# EAGLE schematic hydra (EAGLE 5.06)
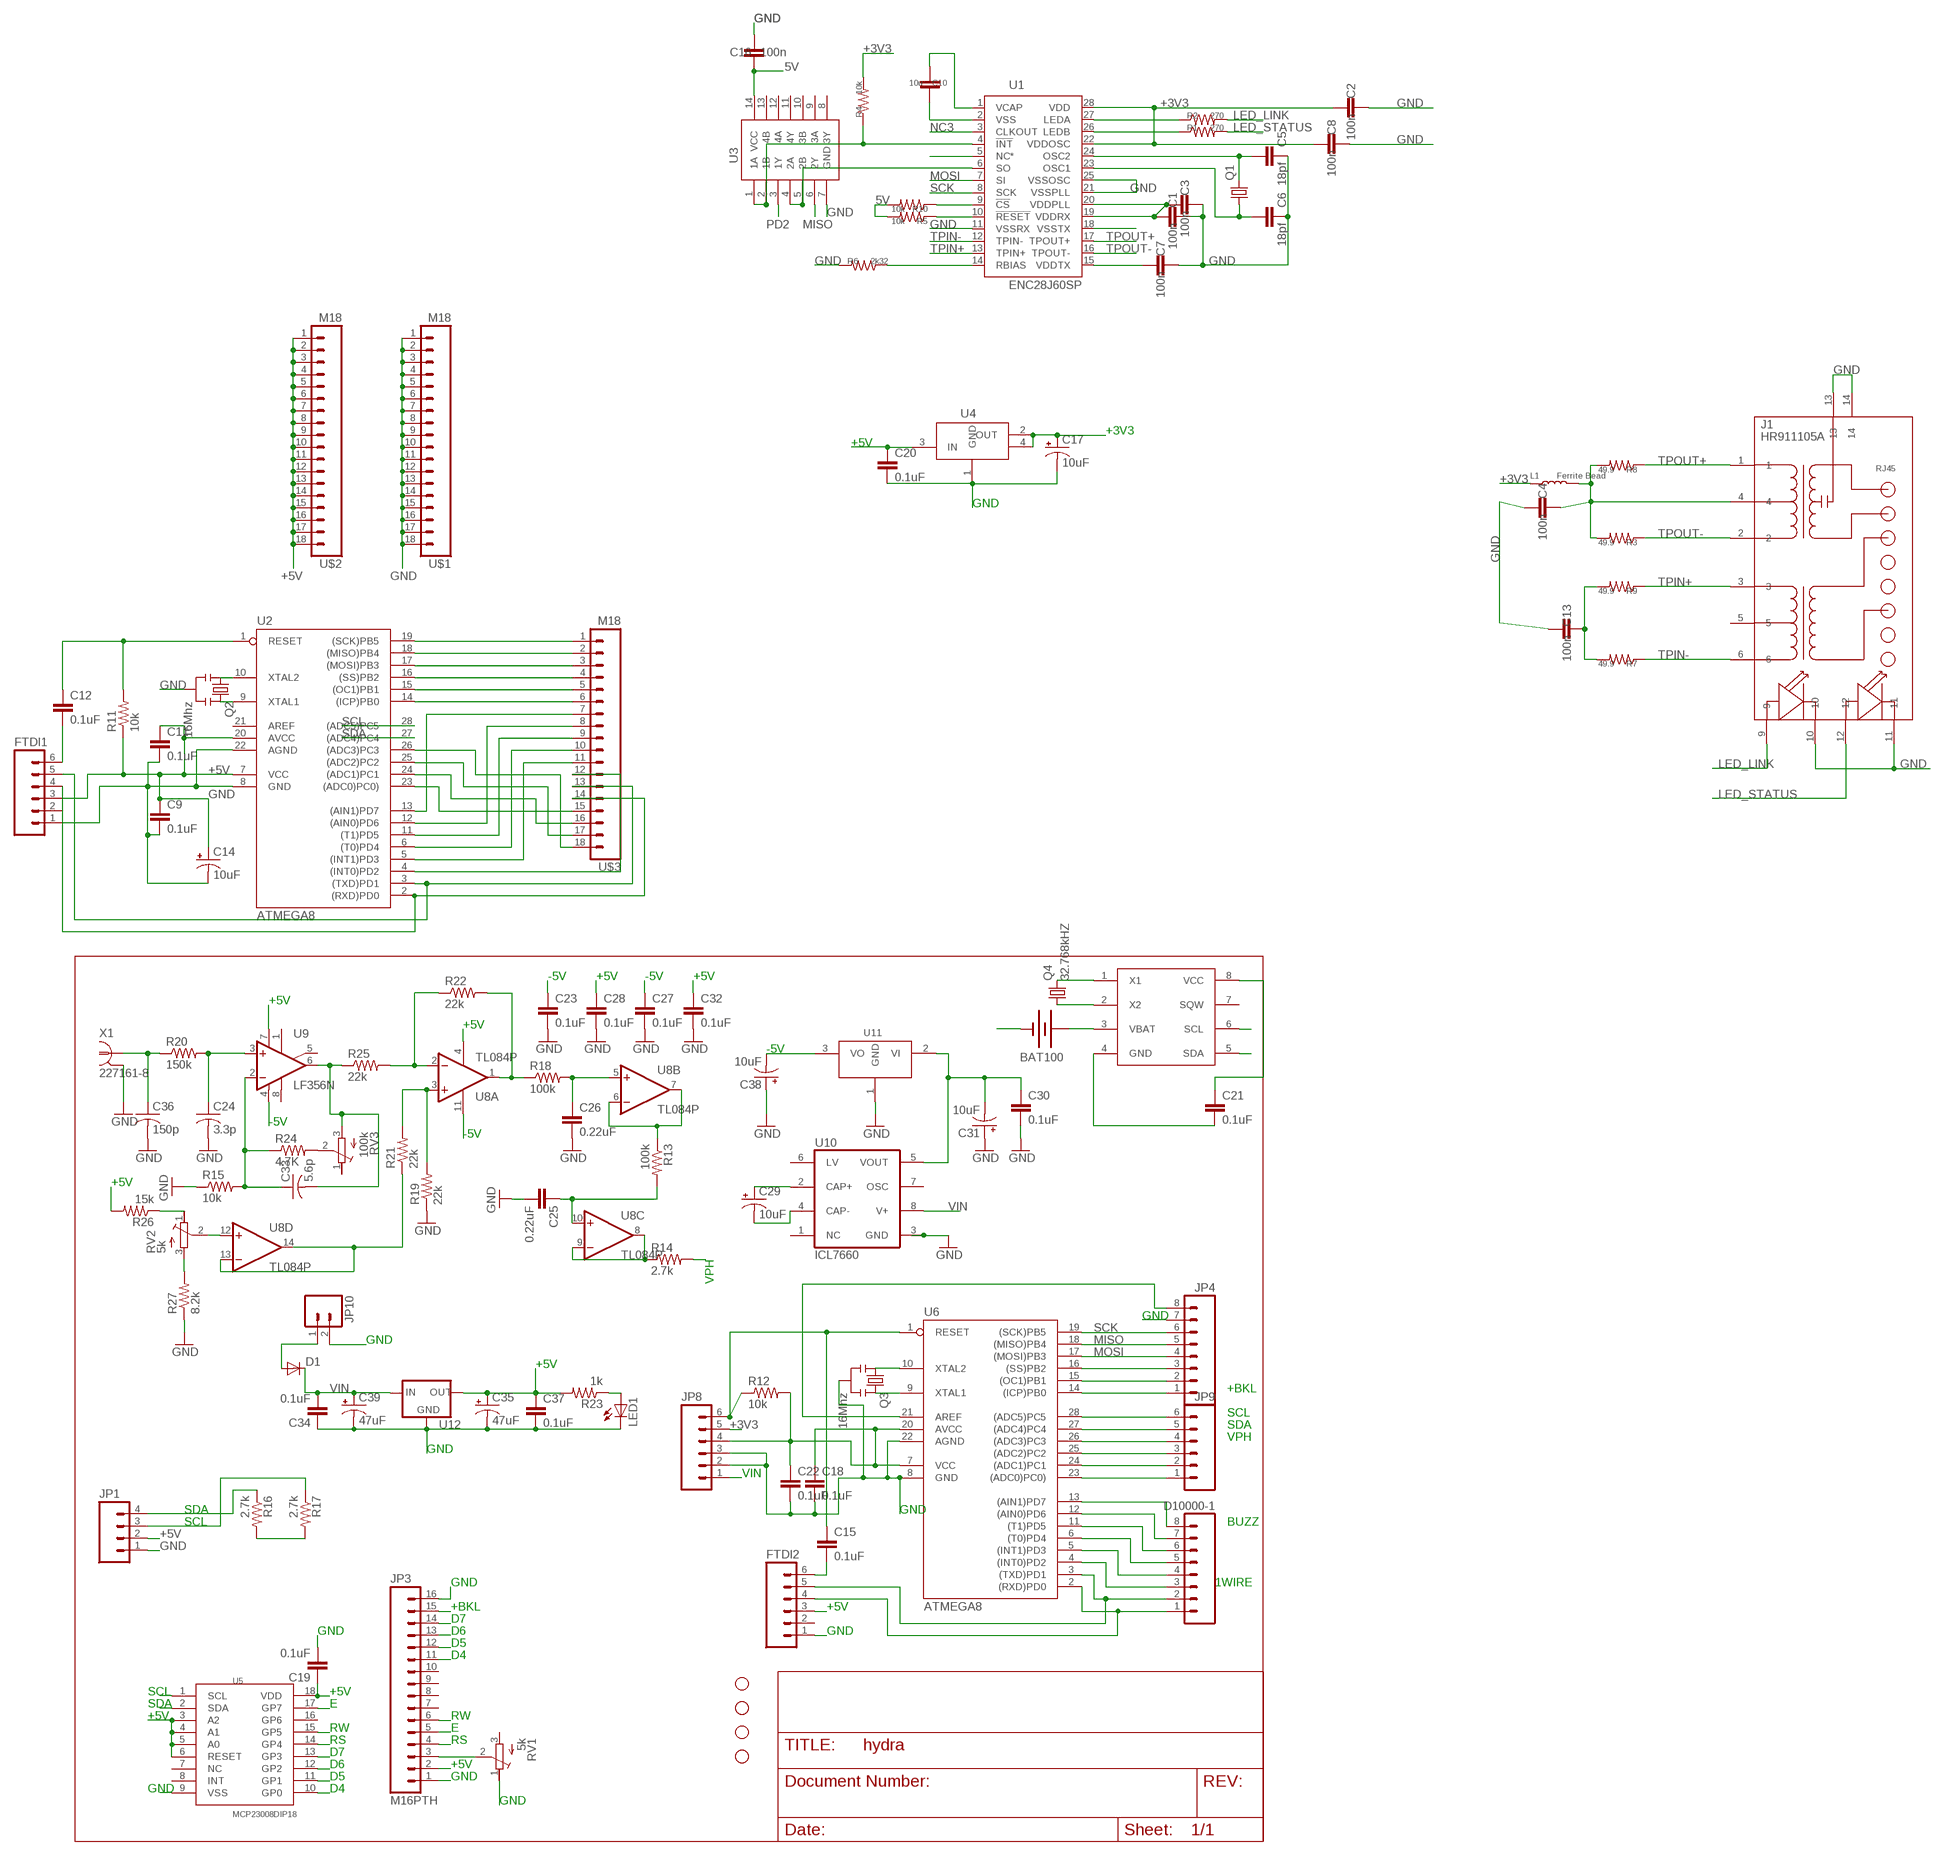
[diagram p0: schematic, sheet 1]

## Parts
BAT100  BATTERY12PTH_KEYSTONE  [BATT_12MM_KEYSTONE]
C1  100n  CAPPTH  [CAP-PTH-SMALL]
C2  100n  CAPPTH  [CAP-PTH-SMALL]
C3  100n  CAPPTH  [CAP-PTH-SMALL]
C4  100n  CAPPTH  [CAP-PTH-SMALL]
C5  18pf  CAPPTH  [CAP-PTH-SMALL]
C6  18pf  CAPPTH  [CAP-PTH-SMALL]
C7  100n  CAPPTH  [CAP-PTH-SMALL]
C8  100n  CAPPTH  [CAP-PTH-SMALL]
C9  0.1uF  CAPPTH  [CAP-PTH-SMALL]
C10  10u  CAP1206  [C1206]
C11  0.1uF  CAPPTH  [CAP-PTH-SMALL]
C12  0.1uF  CAPPTH  [CAP-PTH-SMALL]
C13  100n  CAPPTH  [CAP-PTH-SMALL]
C14  10uF  CPOL-USE2-5  [E2-5]
C15  0.1uF  CAPPTH  [CAP-PTH-SMALL]
C16  100n  CAPPTH  [CAP-PTH-SMALL]
C17  10uF  CAP_POL5MMPTH  [CAP5MM2MM]
C18  0.1uF  CAPPTH  [CAP-PTH-SMALL]
C19  0.1uF  CAPPTH  [CAP-PTH-SMALL]
C20  0.1uF  CAPPTH  [CAP-PTH-SMALL]
C21  0.1uF  CAPPTH  [CAP-PTH-SMALL]
C22  0.1uF  CAPPTH  [CAP-PTH-SMALL]
C23  0.1uF  CAPPTH  [CAP-PTH-SMALL]
C24  3.3p  C-US025-025X050  [C025-025X050]
C25  0.22uF  CAPPTH  [CAP-PTH-SMALL]
C26  0.22uF  CAPPTH  [CAP-PTH-SMALL]
C27  0.1uF  CAPPTH  [CAP-PTH-SMALL]
C28  0.1uF  CAPPTH  [CAP-PTH-SMALL]
C29  10uF  CPOL-USE2-5  [E2-5]
C30  0.1uF  CAPPTH  [CAP-PTH-SMALL]
C31  10uF  CPOL-USE2-5  [E2-5]
C32  0.1uF  CAPPTH  [CAP-PTH-SMALL]
C33  5.6p  C-US025-025X050  [C025-025X050]
C34  0.1uF  CAPPTH  [CAP-PTH-SMALL]
C35  47uF  CPOL-USE2-5  [E2-5]
C36  150p  C-US025-025X050  [C025-025X050]
C37  0.1uF  CAPPTH  [CAP-PTH-SMALL]
C38  10uF  CPOL-USE2-5  [E2-5]
C39  47uF  CPOL-USE2-5  [E2-5]
D1  DIODEPTH  [DIODE-1N4001]
D10000-1  M08  [1X08]
FTDI1  M06SIP  [1X06]
FTDI2  M06SIP  [1X06]
J1  HR911105A  [HR911105A]
JP1  M04PTH  [1X04]
JP2  STAND-OFF  [STAND-OFF]
JP3  M16PTH  [1X16]
JP4  M08  [1X08]
JP5  STAND-OFF  [STAND-OFF]
JP6  STAND-OFF  [STAND-OFF]
JP7  STAND-OFF  [STAND-OFF]
JP8  M06SIP  [1X06]
JP9  M06SIP  [1X06]
JP10  M02POLAR  [MOLEX-1X2]
L1  Ferrite Bead  L0805  [0805]
LED1  LED3MM  [LED3MM]
Q1  CRYSTALHC49S  [HC49/S]
Q2  16Mhz  RESONATORPTH  [RESONATOR-PTH]
Q3  16Mhz  RESONATORPTH  [RESONATOR-PTH]
Q4  32.768kHZ  CRYSTALTC26H  [TC26H]
R1  270  R-US_0204/7  [0204/7]
R2  270  R-US_0204/7  [0204/7]
R3  49.9  R-US_0204/7  [0204/7]
R4  10k  R-US_0204/7  [0204/7]
R5  10k  R-US_0204/7  [0204/7]
R6  2k32  R-US_0204/7  [0204/7]
R7  49.9  R-US_0204/7  [0204/7]
R8  49.9  R-US_0204/7  [0204/7]
R9  49.9  R-US_0204/7  [0204/7]
R10  10k  R-US_0204/7  [0204/7]
R11  10k  R-US_0204/7  [0204/7]
R12  10k  R-US_0204/7  [0204/7]
R13  100k  R-US_0204/7  [0204/7]
R14  2.7k  R-US_0204/7  [0204/7]
R15  10k  R-US_0204/7  [0204/7]
R16  2.7k  R-US_0204/7  [0204/7]
R17  2.7k  R-US_0204/7  [0204/7]
R18  100k  R-US_0204/7  [0204/7]
R19  22k  R-US_0204/7  [0204/7]
R20  150k  R-US_0204/7  [0204/7]
R21  22k  R-US_0204/7  [0204/7]
R22  22k  R-US_0204/7  [0204/7]
R23  1k  R-US_0204/7  [0204/7]
R24  4.7K  R-US_0204/7  [0204/7]
R25  22k  R-US_0204/7  [0204/7]
R26  15k  R-US_0204/7  [0204/7]
R27  8.2k  R-US_0204/7  [0204/7]
RV1  5k  R-TRIMMT93YA  [RTRIMT93YA]
RV2  5k  R-TRIMMT93YA  [RTRIMT93YA]
RV3  100k  R-TRIMMT93YA  [RTRIMT93YA]
U1  ENC28J60SP  [DIL28-3]
U2  ATMEGA8  AT90S4433P  [DIL28-3]
U3  SN74HCT08NDIL14  [DIL14]
U4  LD1117  [SOT223]
U5  MCP23008DIP18  [DIL18]
U6  ATMEGA8  AT90S4433P  [DIL28-3]
U7  DS1307DS1307  [DIP08]
U8  TL084P  [DIL14]
U9  LF356N  [DIL08]
U10  ICL7660  ICL7660CPA  [DIL08]
U11  79XX  [TO92-]
U12  V_REG_78XXTO252  [TO252]
U$1  M18  [1X18]
U$2  M18  [1X18]
U$3  M18  [1X18]
X1  227161-8  [AMP_227161]

## Nets
5V: C16.2 R5.2 R10.2 U3.14(VCC)
+3V3: C1.2 C2.2 C3.2 C7.2 C8.2 C17.+ JP8.5 L1.1 R4.2 U1.15(VDDTX) U1.19(VDDRX) U1.20(VDDPLL) U1.22(VDDOSC) U1.28(VDD) U4.2(OUT) U4.4(TAB)
+5V [power]: C9.1 C11.1 C14.+ C18.1 C19.1 C20.1 C21.1 C22.1 C28.1 C32.1 C35.+ C37.1 FTDI1.3 FTDI2.3 JP1.2 JP3.2 JP8.4 R11.1 R12.2 R16.2 R17.2 R23.2 R26.2 U2.7(VCC) U2.20(AVCC) U4.3(IN) U5.3(A2) U5.4(A1) U5.5(A0) U5.6(RESET) U5.18(VDD) U6.7(VCC) U6.20(AVCC) U7.8(VCC) U8.4(P:V+) U9.7(V+) U12.2(OUT) U$2.1 U$2.2 U$2.3 U$2.4 U$2.5 U$2.6 U$2.7 U$2.8 U$2.9 U$2.10 U$2.11 U$2.12 U$2.13 U$2.14 U$2.15 U$2.16 U$2.17 U$2.18
+BKL: JP3.15 JP4.1 U6.14((ICP)PB0)
-5V [power]: C23.1 C27.1 C38.- U8.11(P:V-) U9.4(V-) U11.3(VO)
B2: R10.1 U1.9(!CS)
BUZZ: D10000-1.8 U6.13((AIN1)PD7)
D4: JP3.11 U5.10(GP0)
D5: JP3.12 U5.11(GP1)
D6: JP3.13 U5.12(GP2)
D7: JP3.14 U5.13(GP3)
E: JP3.5 U5.17(GP7)
GND [power]: BAT100.GND(-) C1.1 C2.1 C3.1 C4.2 C5.1 C6.1 C7.1 C8.1 C9.2 C10.1 C11.2 C13.2 C14.- C16.1 C17.- C18.2 C19.2 C20.2 C21.2 C22.2 C23.2 C24.2 C25.2 C26.2 C27.2 C28.2 C30.2 C31.+ C32.2 C34.1 C35.- C36.2 C37.2 C38.+ C39.- FTDI1.1 FTDI2.1 J1.10 J1.11 J1.13 J1.14 JP1.1 JP3.1 JP3.16 JP4.7 JP8.2 JP8.3 JP10.2 LED1.K(C) Q2.2 Q3.2 R6.2 R15.1 R19.1 R27.1 RV1.1(A) U1.2(VSS) U1.11(VSSRX) U1.18(VSSTX) U1.21(VSSPLL) U1.25(VSSOSC) U2.8(GND) U2.22(AGND) U3.7(GND) U4.1(GND) U5.9(VSS) U6.8(GND) U6.22(AGND) U7.4(GND) U10.3(GND) U11.1(GND) U12.3(GND) U$1.1 U$1.2 U$1.3 U$1.4 U$1.5 U$1.6 U$1.7 U$1.8 U$1.9 U$1.10 U$1.11 U$1.12 U$1.13 U$1.14 U$1.15 U$1.16 U$1.17 U$1.18 X1.2(GND)
IR: D10000-1.5 U6.6((T0)PD4)
LED_LINK: J1.9 R2.2
LED_STATUS: J1.12 R1.2
MISO: JP4.5 U3.6(2Y) U6.18((MISO)PB4)
MOSI: JP4.4 U1.7(SI) U6.17((MOSI)PB3)
N$1: Q4.1 U7.2(X2)
N$2: Q4.2 U7.1(X1)
N$3: BAT100.V+(+) U7.3(VBAT)
N$4: C29.+ U10.2(CAP+)
N$5: C29.- U10.4(CAP-)
N$6: C33.2 R25.1 RV3.3(E) U9.6(OUT)
N$7: R22.1 R25.2 U8.2(A:-IN)
N$8: C24.1 R20.2 U9.3(+IN)
N$9: C15.1 JP8.6 R12.1 U6.1(RESET)
N$10: JP3.3 RV1.2(S)
N$11: R24.2 RV3.2(S)
N$12: R19.2 R21.2 U8.3(A:+IN)
N$13: C36.1 R20.1 X1.1
N$14: C33.1 R15.2 R24.1 U9.2(-IN)
N$15: R18.1 R22.2 U8.1(A:OUT)
N$16: C26.1 R18.2 U8.5(B:+IN)
N$17: R13.1 U8.6(B:-IN) U8.7(B:OUT)
N$18: C25.1 R13.2 U8.10(C:+IN)
N$19: RV2.2(S) U8.12(D:+IN)
N$20: R21.1 U8.13(D:-IN) U8.14(D:OUT)
N$21: R14.1 U8.8(C:OUT) U8.9(C:-IN)
N$22: R26.1 RV2.1(A)
N$23: R27.2 RV2.3(E)
N$24: LED1.A R23.1
N$25: D10000-1.4 U6.5((INT1)PD3)
N$26: U2.26((ADC3)PC3) U$3.18
N$27: U2.25((ADC2)PC2) U$3.17
N$28: D10000-1.6 U6.11((T1)PD5)
N$29: D10000-1.7 U6.12((AIN0)PD6)
N$30: C10.2 U1.1(VCAP)
N$31: JP9.1 U6.23((ADC0)PC0))
N$32: JP9.2 U6.24((ADC1)PC1)
N$33: R6.1 U1.14(RBIAS)
N$34: JP9.3 U6.25((ADC2)PC2)
N$35: C4.1 J1.4 L1.2 R3.2 R8.2
N$36: Q3.3 U6.9(XTAL1)
N$37: C13.1 R7.2 R9.2
N$38: Q3.1 U6.10(XTAL2)
N$39: R2.1 U1.27(LEDA)
N$40: JP4.2 U6.15((OC1)PB1)
N$41: JP4.3 U6.16((SS)PB2)
N$42: R1.1 U1.26(LEDB)
N$43: D1.A JP10.1
N$45: JP4.8 U6.21(AREF)
N$47: U2.24((ADC1)PC1) U$3.16
N$49: D10000-1.1 FTDI2.4 U6.2((RXD)PD0)
N$50: D10000-1.2 FTDI2.5 U6.3((TXD)PD1)
N$51: C15.2 FTDI2.6
N$52: U2.23((ADC0)PC0)) U$3.15
N$53: FTDI1.4 U2.2((RXD)PD0) U$3.14
N$54: FTDI1.5 U2.3((TXD)PD1) U$3.13
N$55: U2.4((INT0)PD2) U$3.12
N$56: U2.5((INT1)PD3) U$3.11
N$57: U2.6((T0)PD4) U$3.10
N$58: U2.11((T1)PD5) U$3.9
N$59: U2.12((AIN0)PD6) U$3.8
N$60: U2.13((AIN1)PD7) U$3.7
N$61: U2.14((ICP)PB0) U$3.6
N$62: U2.15((OC1)PB1) U$3.5
N$63: U2.16((SS)PB2) U$3.4
N$64: U2.17((MOSI)PB3) U$3.3
N$65: U2.19((SCK)PB5) U$3.1
N$66: U2.18((MISO)PB4) U$3.2
N$67: Q2.1 U2.10(XTAL2)
N$68: Q2.3 U2.9(XTAL1)
N$69: C12.2 FTDI1.6
N$70: C12.1 R11.2 U2.1(RESET)
NC3: U1.3(CLKOUT)
NC5: U1.5(NC*)
OSC1: C6.2 Q1.1 U1.23(OSC1)
OSC2: C5.2 Q1.2 U1.24(OSC2)
PD2: D10000-1.3 U3.3(1Y) U6.4((INT0)PD2)
RS: JP3.4 U5.14(GP4)
RST: R5.1 U1.10(!RESET)
RW: JP3.6 U5.15(GP5)
SCK: JP4.6 U1.8(SCK) U6.19((SCK)PB5)
SCL: JP1.4 JP9.6 R16.1 U2.28((ADC5)PC5) U5.1(SCL) U6.28((ADC5)PC5) U7.6(SCL)
SDA: JP1.3 JP9.5 R17.1 U2.27((ADC4)PC4) U5.2(SDA) U6.27((ADC4)PC4) U7.5(SDA)
TP1: R4.1 U1.4(!INT) U3.1(1A) U3.2(1B)
TP2: U1.6(SO) U3.4(2A) U3.5(2B)
TPIN+: J1.3 R9.1 U1.13(TPIN+)
TPIN-: J1.6 R7.1 U1.12(TPIN-)
TPOUT+: J1.1 R8.1 U1.17(TPOUT+)
TPOUT-: J1.2 R3.1 U1.16(TPOUT-)
U5VIN [power]: C30.1 C31.- U10.5(VOUT) U11.2(VI)
VIN [power]: C34.2 C39.+ D1.C JP8.1 U10.8(V+) U12.1(IN)
VPH: JP9.4 R14.2 U6.26((ADC3)PC3)
Unconnected: FTDI1.2 FTDI2.2 J1.5 JP3.7 JP3.8 JP3.9 JP3.10 RV1.3(E) RV3.1(A) U2.21(AREF) U3.8(3Y) U3.9(3A) U3.10(3B) U3.11(4Y) U3.12(4A) U3.13(4B) U5.7(NC) U5.8(INT) U5.16(GP6) U7.7(SQW) U9.1(ON1) U9.5(ON2) U9.8(OPT) U10.1(NC) U10.6(LV) U10.7(OSC)

## Notes on the sheet
- +3V3
- +5V
- GND
- -5V | +5V | -5V | +5V
- +5V
- +5V
- -5V
- -5V
- -5V
- +5V
- VPH
- GND
- GND
- +5V
- +BKL
- SCL
- SDA
- VPH
- GND
- VIN
- SDA | GND
- SCL | BUZZ
- GND | 1WIRE
- +BKL | +5V
- D7
- GND | D6 | GND
- D5
- D4
- SCL | +5V
- SDA | E
- +5V | RW
- RW | E
- RS | RS
- D7
- D6 | +5V
- D5 | GND
- GND | D4
- GND

## Library data of the parts
BAT100 = _allyourbase:BATTERY: Battery Holders Various common sizes : AA, AAA, 20mm coin cell and 12mm coin cell.
C1-C13 C15 C16 C18-C23 C25-C28 C30 C32 C34 C37 = _allyourbase:CAP: Capacitor Standard 0603 ceramic capacitor, and 0.1" leaded capacitor.
C14 C29 C31 C35 C38 C39 = rcl:CPOL-US: POLARIZED CAPACITOR, American symbol
C17 = _allyourbase:CAP_POL: Capacitor Polarized These are standard SMD and PTH capacitors. Normally 10uF, 47uF, and 100uF in electrolytic and tantalum varieties. Always verify the external diameter of the through hole cap, it varies with capacity, voltage, and manufacturer. The EIA devices should be standard.
C24 C33 C36 = rcl:C-US: CAPACITOR, American symbol
D1 = _allyourbase:DIODE: Diode These are standard reverse protection diodes and small signal diodes. SMA package can handle up to about 1A. SOD-323 can handle about 200mA. What the SOD-323 package when ordering, there are some mfgs out there that are 5-pin packages.
D10000-1 JP4 = _allyourbase:M08: Header 8 Standard 8-pin 0.1" header. Use with straight break away headers (SKU : PRT-00116), right angle break away headers (PRT-00553), swiss pins (PRT-00743), machine pins (PRT-00117), and female headers (PRT-00115).
FTDI1 FTDI2 JP8 JP9 = _allyourbase:M06: Header 6 Standard 6-pin 0.1" header. Use with straight break away headers (SKU : PRT-00116), right angle break away headers (PRT-00553), swiss pins (PRT-00743), machine pins (PRT-00117), and female headers (PRT-00115). Molex polarized connector foot print use with SKU : PRT-08094 with associated crimp pins and housings. NOTES ON THE VARIANTS LOCK and LOCK_LONGPADS... This footprint was designed to help hold the alignment of a through-hole component (i.e. 6-pin header) while soldering it into place. You may notice that each hole has been shifted either up or down by 0.005 of an inch from it's more standard position (which is a perfectly straight line). This slight alteration caused the pins (the squares in the middle) to touch the edges of the holes. Because they are alternating, it causes a "brace" to hold the component in place. 0.005 has proven to be the perfect amount of "off-center" position when using our standard breakaway headers. Although looks a little odd when you look at the bare footprint, once you have a header in there, the alteration is very hard to notice. Also, if you push a header all the way into place, it is covered up entirely on the bottom side. This idea of altering the position of holes to aid alignment will be further integrated into the Sparkfun Library for other footprints. It can help hold any component with 3 or more connection pins.
J1 = _allyourbase:HR911105A
JP1 = _allyourbase:M04: Header 4 Standard 4-pin 0.1" header. Use with straight break away headers (SKU : PRT-00116), right angle break away headers (PRT-00553), swiss pins (PRT-00743), machine pins (PRT-00117), and female headers (PRT-00115). Molex polarized connector foot print use with SKU : PRT-08231 with associated crimp pins and housings.
JP2 JP5-JP7 = _allyourbase:STAND-OFF: Stand Off This is the mechanical footprint for a #4 phillips button head screw. Use the keepout ring to avoid running the screw head into surrounding components. SKU : PRT-00447
JP3 = SparkFun:M16
JP10 = _allyourbase:M02: Header 2 Standard 2-pin 0.1" header. Use with straight break away headers (SKU : PRT-00116), right angle break away headers (PRT-00553), swiss pins (PRT-00743), machine pins (PRT-00117), and female headers (PRT-00115). Molex polarized connector foot print use with SKU : PRT-08233 with associated crimp pins and housings.
L1 = CPT_SMD:L0805
LED1 = SparkFun:LED: LEDs Standard schematic elements and footprints for 5mm, 3mm, 1206, and 0603 sized LEDs. 5mm - Spark Fun Electronics SKU : COM-00529 (and others)
Q1 Q4 = _allyourbase:CRYSTAL: CRYSTAL
Q2 Q3 = _allyourbase:RESONATOR: Resonator Small SMD resonator. This is the itty bitty 10/20MHz resonators with built in caps. CSTCE10M0G55 and CSTCE20M0V53. Footprint has been reviewed closely but hasn't been tested yet.
R1-R27 = _allyourbase:R-US_: RESISTOR, American symbol
RV1-RV3 = resistor:R-TRIMM: Trimm resistor
U1 = _allyourbase:ENC28J60: Stand-Alone Ethernet Controller with SPI Interface Source: http://ww1.microchip.com/downloads/en/DeviceDoc/39662c.pdf
U2 U6 = atmel:AT90S4433: MICROCONTROLLER 4 Kbytes FLASH 128 bytes SRAM 256 bytes EEPROM UART 6-channel 10 bit ADC
U3 = _allyourbase:SN74HCT08N
U4 = _allyourbase:LD1117
U5 = _allyourbase:MCP23008
U7 = _allyourbase:DS1307
U8 = _allyourbase:TL084: OP AMP
U9 = _allyourbase:LF356: OP AMP
U10 = _allyourbase:ICL7660CPA: VOLTAGE CONVERTER
U11 = _allyourbase:79XX
U12 = _allyourbase:V_REG_78XX: Voltage Regulator Standard 7805 5V regulator. IGO (Input Ground Output). Spark Fun Electronics SKU : COM-00107
U$1-U$3 = _allyourbase:M18
X1 = con-coax:?227161*: JACK, RIGHT ANGLE, 50 OHM, PCB, BNC Source: amp_227161.pdf

## Net classes
0 default: width 0.203 mm, drill 0.508 mm, clearance 0.203 mm
1 power: width 0.254 mm, drill 0.508 mm, clearance 0.203 mm